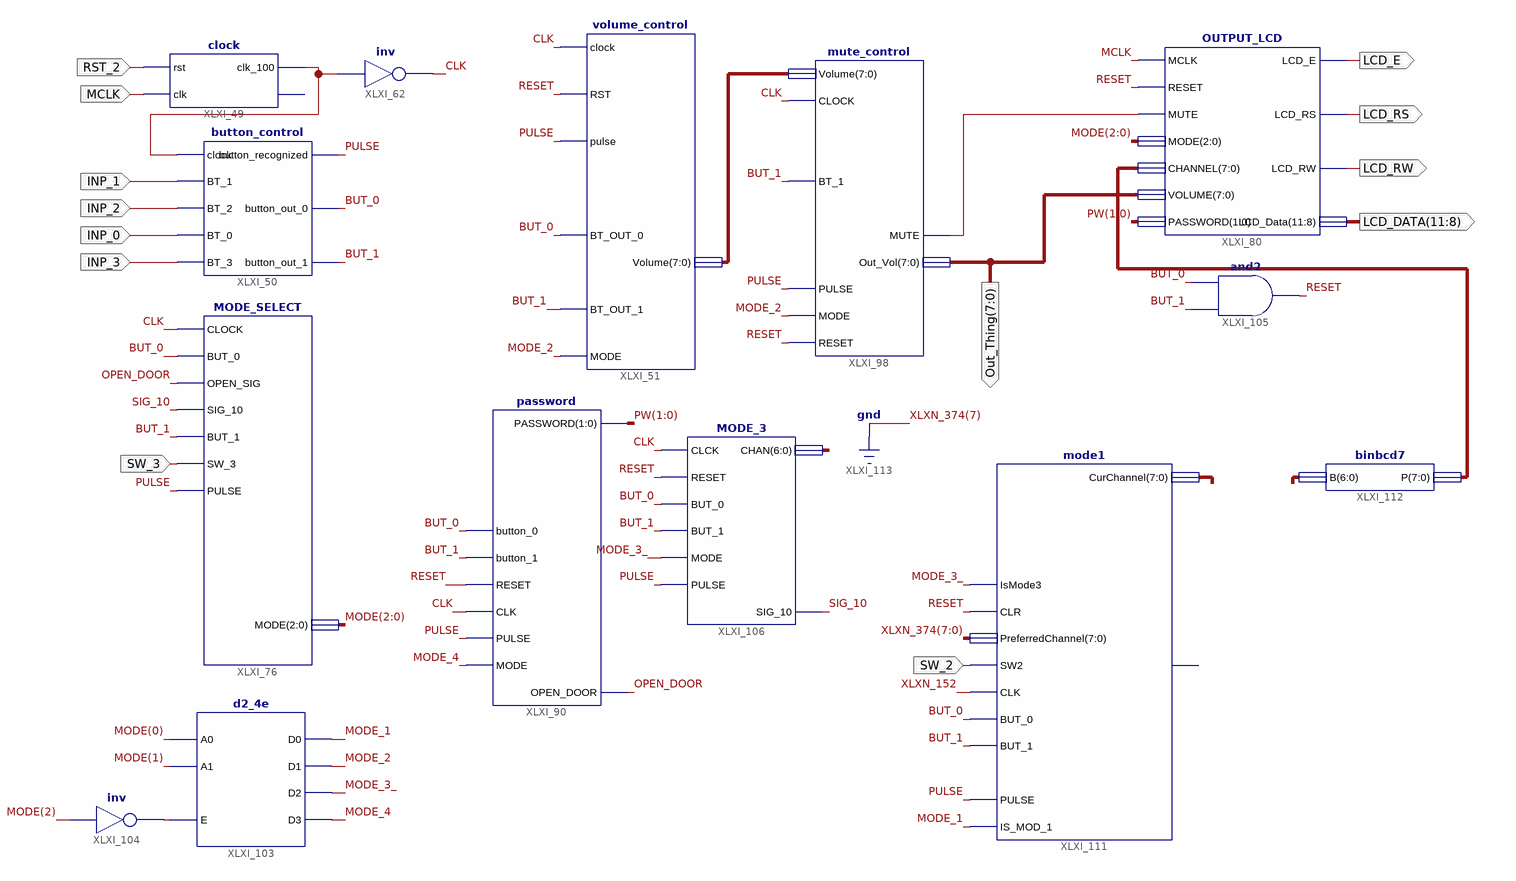
[diagram p0: schematic sheet 1]
// Xilinx ISE schematic Top_Design_Thing.sch (spartan3e) as structural Verilog: 14 symbols, 13 ports
module Top_Design_Thing (
  input  INP_3,
  input  INP_2,
  input  INP_1,
  input  INP_0,
  input  MCLK,
  input  RST_2,
  input  SW_3,
  input  SW_2,
  output LCD_E,
  output LCD_RS,
  output LCD_RW,
  output [11:8] LCD_DATA,
  output [7:0] Out_Thing
);

  wire BUT_0, BUT_1, CLK, MODE_1, MODE_2, MODE_3_, MODE_4, OPEN_DOOR, PULSE, RESET, SIG_10, XLXN_152,
       XLXN_313, XLXN_317;
  wire [1:0] PW;
  wire [2:0] MODE;
  wire [6:0] XLXN_374;
  wire [7:0] XLXN_246, XLXN_252, XLXN_362;

  clock XLXI_49 (.rst(RST_2), .clk(MCLK), .clk_100(XLXN_152));  // open: clk_2K
  button_control XLXI_50 (
    .clock(XLXN_152), .BT_1(INP_1), .BT_2(INP_2), .BT_0(INP_0), .BT_3(INP_3), .button_recognized(PULSE),
    .button_out_0(BUT_0), .button_out_1(BUT_1));
  not XLXI_62 (CLK, XLXN_152);
  OUTPUT_LCD XLXI_80 (
    .MCLK(MCLK), .RESET(RESET), .MUTE(XLXN_313), .MODE(MODE), .CHANNEL(XLXN_252), .VOLUME(Out_Thing),
    .PASSWORD(PW), .LCD_E(LCD_E), .LCD_RS(LCD_RS), .LCD_RW(LCD_RW), .LCD_Data(LCD_DATA));
  volume_control XLXI_51 (
    .clock(CLK), .RST(RESET), .pulse(PULSE), .BT_OUT_0(BUT_0), .BT_OUT_1(BUT_1), .Volume(XLXN_246),
    .MODE(MODE_2));
  MODE_SELECT XLXI_76 (
    .CLOCK(CLK), .BUT_0(BUT_0), .OPEN_SIG(OPEN_DOOR), .SIG_10(SIG_10), .BUT_1(BUT_1), .SW_3(SW_3),
    .PULSE(PULSE), .MODE(MODE));
  mute_control XLXI_98 (
    .Volume(XLXN_246), .CLOCK(CLK), .BT_1(BUT_1), .PULSE(PULSE), .MODE(MODE_2), .Out_Vol(Out_Thing),
    .MUTE(XLXN_313), .RESET(RESET));
  d2_4e XLXI_103 (.A0(MODE[0]), .A1(MODE[1]), .E(XLXN_317), .D0(MODE_1), .D1(MODE_2), .D2(MODE_3_), .D3(MODE_4));
  not XLXI_104 (XLXN_317, MODE[2]);
  and XLXI_105 (RESET, BUT_1, BUT_0);
  password XLXI_90 (
    .button_0(BUT_0), .button_1(BUT_1), .RESET(RESET), .CLK(CLK), .PULSE(PULSE), .MODE(MODE_4),
    .PASSWORD(PW), .OPEN_DOOR(OPEN_DOOR));
  MODE_3 XLXI_106 (
    .CLCK(CLK), .RESET(RESET), .BUT_0(BUT_0), .MODE(MODE_3_), .PULSE(PULSE), .BUT_1(BUT_1), .CHAN(XLXN_374),
    .SIG_10(SIG_10));
  mode1 XLXI_111 (
    .IsMode3(MODE_3_), .CLR(RESET), .CLK(XLXN_152), .SW2(SW_2), .BUT_0(BUT_0), .BUT_1(BUT_1),
    .PreferredChannel({1'b0, XLXN_374}), .PULSE(PULSE), .IS_MOD_1(MODE_1), .CurChannel(XLXN_362));  // open: LED
  binbcd7 XLXI_112 (.B(XLXN_362[6:0]), .P(XLXN_252));
endmodule
